# EAGLE design Rotary Encoder (EAGLE 6.2)
SKAARHOJ 2012 Rotary Encoder Breakout Board
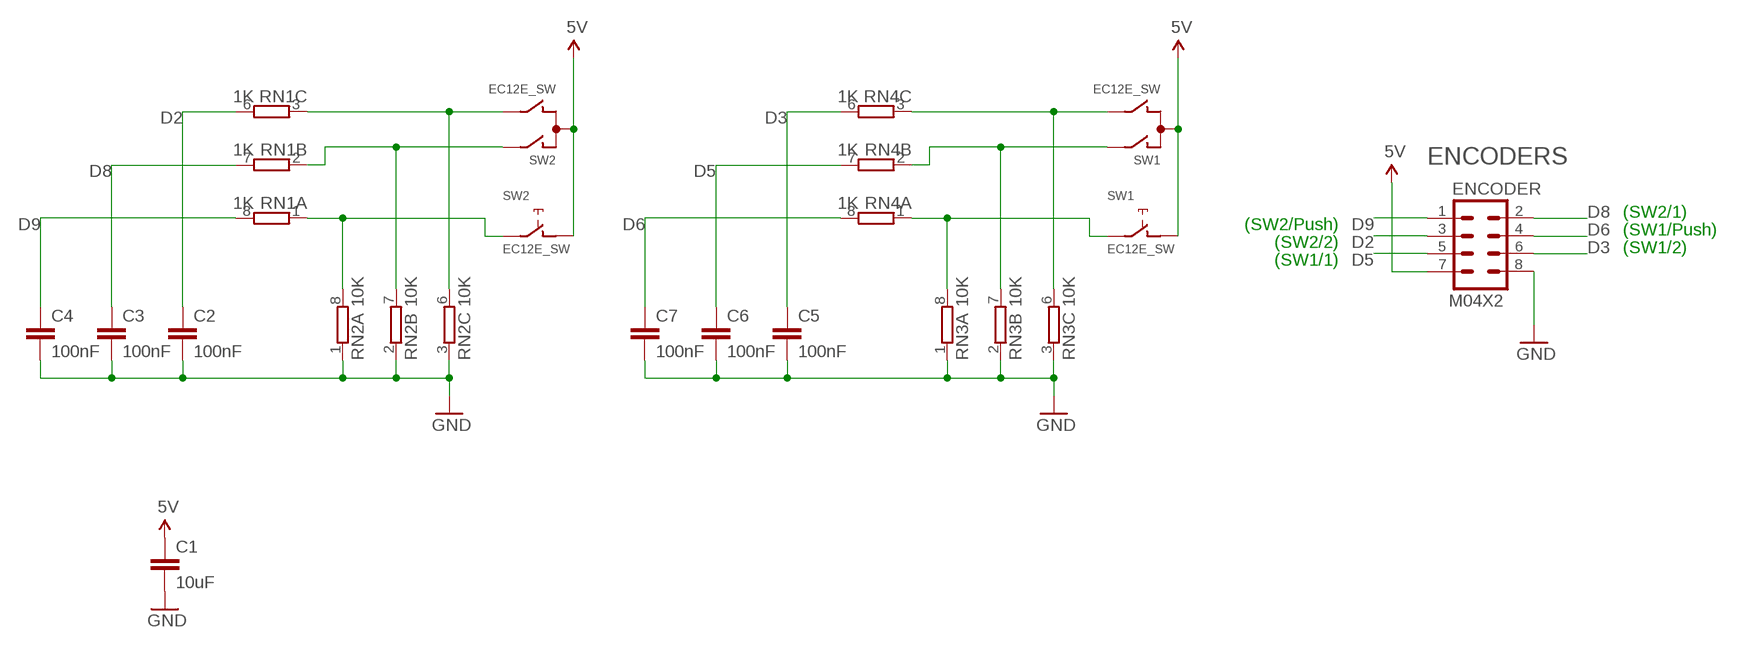
[diagram p0: schematic, sheet 1]

## Parts
C1  10uF  CAP0603-CAP  [0603-CAP]
C2  100nF  CAP0603-CAP  [0603-CAP]
C3  100nF  CAP0603-CAP  [0603-CAP]
C4  100nF  CAP0603-CAP  [0603-CAP]
C5  100nF  CAP0603-CAP  [0603-CAP]
C6  100nF  CAP0603-CAP  [0603-CAP]
C7  100nF  CAP0603-CAP  [0603-CAP]
ENCODER  M04X2  [2X4]
RN1  1K  4R-NCAY16  [CAY16_HAND]
RN2  10K  4R-NCAY16  [CAY16_HAND]
RN3  10K  4R-NCAY16  [CAY16_HAND]
RN4  1K  4R-NCAY16  [CAY16_HAND]
SW1  EC12E_SW  [ALPS_EC12E_SW]
SW2  EC12E_SW  [ALPS_EC12E_SW]

## Nets
5V [Power]: C1.1 ENCODER.7 SW1.C SW1.D SW2.C SW2.D
D2: C2.1 ENCODER.3 RN1.6
D3: C5.1 ENCODER.6 RN4.6
D5: C6.1 ENCODER.5 RN4.7
D6: C7.1 ENCODER.4 RN4.8
D8: C3.1 ENCODER.2 RN1.7
D9: C4.1 ENCODER.1 RN1.8
GND [Power]: C1.2 C2.2 C3.2 C4.2 C5.2 C6.2 C7.2 ENCODER.8 RN2.1 RN2.2 RN2.3 RN3.1 RN3.2 RN3.3
N$1: RN1.3 RN2.6 SW2.B
N$2: RN3.6 RN4.3 SW1.B
N$3: RN3.7 RN4.2 SW1.A
N$4: RN1.2 RN2.7 SW2.A
N$5: RN1.1 RN2.8 SW2.E
N$6: RN3.8 RN4.1 SW1.E
Unconnected: RN1.4 RN1.5 RN2.4 RN2.5 RN3.4 RN3.5 RN4.4 RN4.5 SW1.GND1(G) SW1.GND2(G) SW2.GND1(G) SW2.GND2(G)

## Notes on the sheet
- ENCODERS
- (SW2/Push) | (SW2/1)
- (SW2/2) | (SW1/Push)
- (SW1/1) | (SW1/2)

## Library data of the parts
C1-C7 = SparkFun:CAP: Capacitor Standard 0603 ceramic capacitor, and 0.1" leaded capacitor.
ENCODER = SparkFun:M04X2
RN1-RN4 = SKAARHOJ:4R-N: Array Chip Resistor Source: RS Component / Phycomp; OC_FARNELL: unknown; OC_NEWARK: unknown
SW1 SW2 = switch-alps:EC12E_SW: ALPS rotary Encoder EC12E series with switch; MPN: EC12E2424407; OC_FARNELL: 1520813; OC_NEWARK: 74M1068

## Net classes
0 default: width 0.203 mm, drill 0.406 mm, clearance 0.203 mm
1 Power: width 0.406 mm, drill 0.61 mm, clearance 0.305 mm

## Board
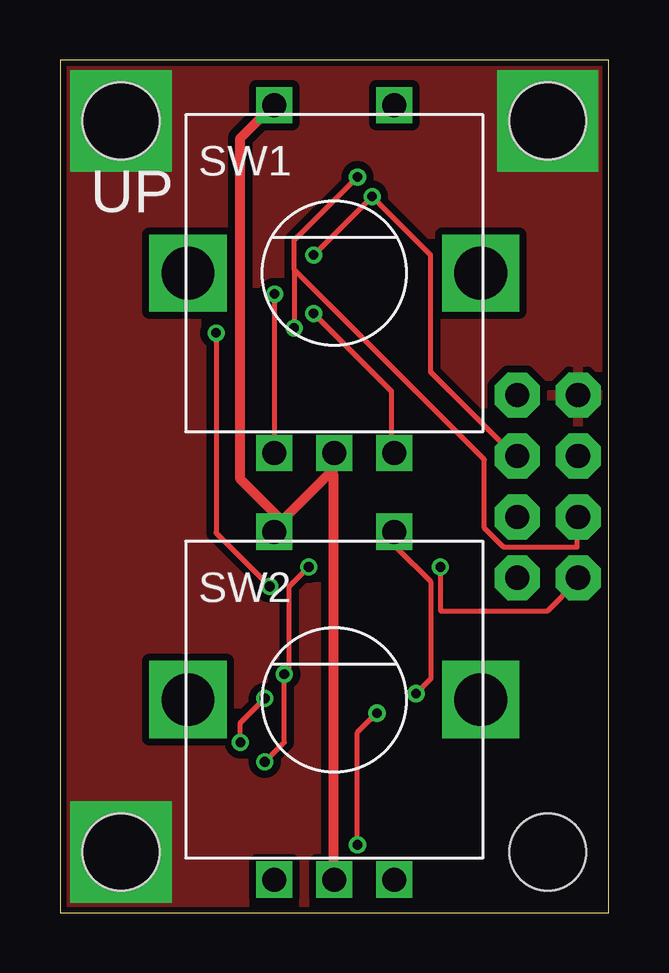
[diagram p1: board, top side]
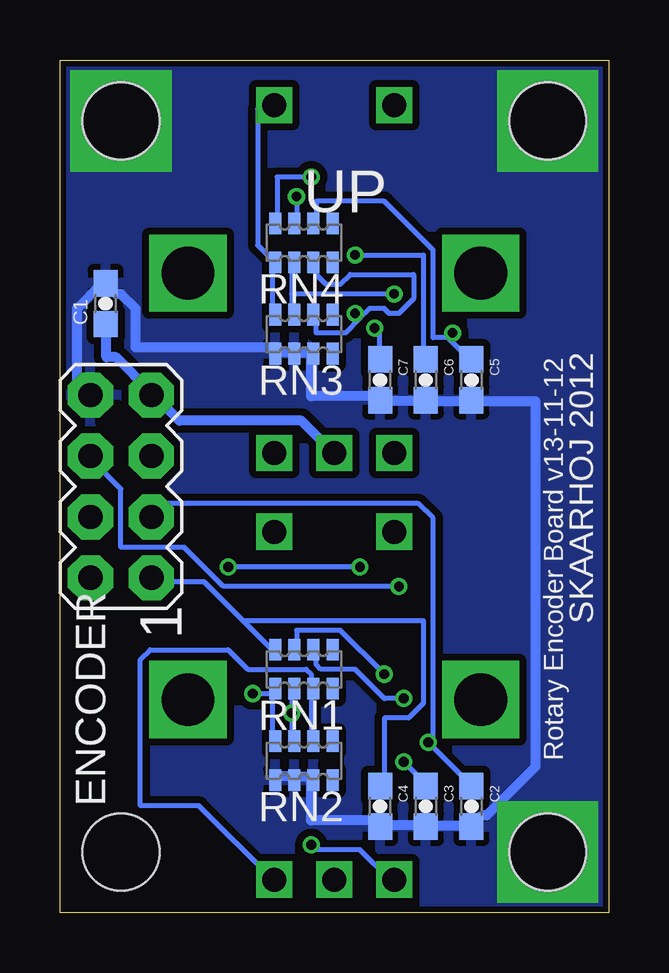
[diagram p2: board, bottom side, seen from below]

Size 22.86 x 35.56 mm. Coordinates in mm from the lower left corner, seen from the top.
Outline: 0,0 22.86,0 22.86,35.56 0,35.56 0,0
Copper layers (1*16): Top 0.035mm / dielectric 1.5mm / Bottom 0.035mm
Design rules: minimum track width 6mil, minimum drill 12mil, track to track 6mil, track to pad 6mil, pad to pad 6mil, via to via 6mil, smd to smd 0mil, copper to edge 10mil, drill to drill 10mil, minimum pad ring 10mil, minimum via ring 6mil, stop-mask expansion 2mil, vias tented up to drill 100mil, thermal gap 10mil
Holes 3.2 mm at 2.54,2.54 2.54,33.02 20.32,33.02 20.32,2.54

### Footprints (pad centres in the part's own frame; a part is rotated, then mirrored left to right if it is on the bottom)
0603-CAP = smd 1.1 x 1: 1 -0.85,0; 2 0.85,0
2X4 = drill 1.016 pad 1.88 octagon: 1 -3.81,-1.27; 2 -3.81,1.27; 3 -1.27,-1.27; 4 -1.27,1.27; 5 1.27,-1.27; 6 1.27,1.27; 7 3.81,-1.27; 8 3.81,1.27
CAY16_HAND = smd 0.5 x 0.904: 1 -1.2,-0.813; 2 -0.4,-0.813; 3 0.4,-0.813; 4 1.2,-0.813; 5 1.2,0.813; 6 0.4,0.813; 7 -0.4,0.813; 8 -1.2,0.813
ALPS_EC12E_SW = drill 1 square: A -2.5,-7.5; B 2.5,-7.5; C 0,-7.5; D -2.5,7; E 2.5,7 | drill 2.2 square: GND1 -6.1,0; GND2 6.1,0

### Placement (x,y rotation side)
C1  20.95,25.4 90 bottom
C2  5.71,4.45 270 bottom
C3  7.62,4.45 270 bottom
C4  9.53,4.45 270 bottom
C5  5.71,22.23 270 bottom
C6  7.62,22.23 270 bottom
C7  9.53,22.23 270 bottom
ENCODER  20.32,17.78 90 bottom
RN1  12.7,10.16 0 bottom
RN2  12.7,6.35 0 bottom
RN3  12.7,24.13 0 bottom
RN4  12.7,27.94 0 bottom
SW1  11.43,26.67 0 top
SW2  11.43,8.89 0 top

### Tracks (layer width: path | path; a pad name or v marks a point on that pad's centre or on a via)
5V
  Top 0.406: 11.28,18.39 11.38,18.49 11.38,19.1 SW1.C | 11.28,18.39 8.94,16.05 SW2.D 9.14,16.46 7.52,18.09 7.52,32.31 8.74,33.53 SW1.D | SW2.C 11.38,1.42 11.38,18.29 11.28,18.39
  Bottom 0.406: C1.1 20.93,24.38 20.93,23.16 20.52,23.16 19.1,21.74 ENCODER.7 18.9,21.54 17.88,20.52 12.8,20.52 11.58,19.3 SW1.C
D2  (via drill 0.41)
  Top 0.203: v8.53,8.94 7.52,7.92 v7.52,7.11
  Bottom 0.203: v8.53,8.94 9.35,8.94 10.57,10.16 11.99,10.16 12.19,10.36 12.19,10.97 RN1.6 | C2.1 5.89,5.49 v7.52,7.11 7.32,7.11 7.32,16.46 7.92,17.07 18.49,17.07 ENCODER.3
D3  (via drill 0.41)
  Top 0.203: v8.74,13.61 6.5,15.85 v6.5,24.18
  Bottom 0.203: 6.71,23.98 7.32,23.98 7.32,27.64 9.35,29.67 12.19,29.67 12.19,28.85 RN4.6 | 6.71,23.98 5.89,23.16 C5.1 | v8.74,13.61 16.05,13.61 17.68,15.24 20.32,15.24 20.32,17.68 21.54,18.9 ENCODER.6 | 6.71,23.98 v6.5,24.18
D5  (via drill 0.41)
  Top 0.203: ENCODER.5 18.9,19.1 15.44,22.55 15.44,27.43 v13.01,29.87 v10.57,27.43
  Bottom 0.203: v13.01,29.87 13.01,28.85 RN4.7 | v10.57,27.43 7.72,27.43 7.72,23.16 C6.1
D6  (via drill 0.41)
  Top 0.203: v12.39,30.68 9.75,28.04 9.75,26.82 | 9.75,26.82 17.68,18.9 17.68,16.05 18.49,15.24 21.54,15.24 21.54,16.46 ENCODER.4 | 9.75,26.82 v9.75,24.38
  Bottom 0.203: v12.39,30.68 13.82,30.68 13.82,28.85 RN4.8 | v9.75,24.38 9.55,24.38 9.55,23.16 C7.1
D8  (via drill 0.41)
  Top 0.203: v8.53,6.3 9.35,7.11 v9.35,9.96 9.55,10.16 9.55,13.61 v10.36,14.43 | v15.85,14.43 15.85,12.6 20.32,12.6 21.54,13.82 ENCODER.2
  Bottom 0.203: v9.35,9.96 11.18,11.79 13.01,11.79 13.01,10.97 RN1.7 | v8.53,6.3 7.72,5.49 C3.1 | v10.36,14.43 v15.85,14.43
D9
  Bottom 0.203: 15.24,12.19 16.87,13.82 18.9,13.82 ENCODER.1 | 15.24,12.19 14.02,10.97 RN1.8 | 15.24,12.19 7.72,12.19 7.72,8.74 8.33,8.13 9.35,8.13 9.35,5.49 C4.1
GND  (via drill 3.2)
  Bottom 0.406: ENCODER.8 21.74,21.74 22.15,21.74 22.15,25.2 21.13,26.21 C1.2 20.93,26.21 20.52,25.81 20.32,25.81 19.71,25.2 19.71,23.57 13.82,23.57 RN3.1 13.82,23.37 13.21,23.37 RN3.2 13.01,23.37 12.39,23.37 RN3.3 12.39,23.16 12.39,21.54 9.55,21.54 C7.2 9.35,21.34 7.72,21.34 C6.2 7.52,21.34 5.89,21.34 C5.2 5.69,21.34 3.05,21.34 3.05,6.1 5.08,4.06 5.28,4.06 5.69,3.66 C2.2 5.89,3.66 7.52,3.66 C3.2 7.72,3.66 9.35,3.66 C4.2 9.35,3.86 12.39,3.86 12.39,5.49 RN2.3 12.39,5.69 13.01,5.69 RN2.2 13.21,5.69 13.82,5.69 RN2.1
  other vias: 2.54,2.54 2.54,33.02 20.32,33.02
  pour Bottom: 0,35.56 22.86,35.56 22.86,0 0,0
  pour Top: 0,35.56 22.86,35.56 22.86,0 0,0
N$1
  Bottom 0.203: 12.39,9.35 12.39,7.32 RN2.6 | 12.39,9.35 12.39,9.96 12.6,10.16 15.04,10.16 15.85,10.97 19.1,10.97 19.51,10.57 19.51,4.47 17.07,4.47 14.02,1.42 SW2.B | 12.39,9.35 RN1.3
N$2  (via drill 0.41)
  Top 0.203: v10.57,24.99 13.82,21.74 13.82,19.3 SW1.B
  Bottom 0.203: 10.36,24.79 9.96,25.2 9.35,25.2 9.14,24.99 8.74,24.99 8.13,25.6 8.13,26.62 10.77,26.62 11.18,26.21 11.79,26.21 12.19,26.62 12.19,27.03 RN4.3 | 10.36,24.79 10.97,24.18 12.19,24.18 12.19,24.79 RN3.6 | v10.57,24.99 10.36,24.79
N$3  (via drill 0.41)
  Top 0.203: v8.94,25.81 8.94,19.3 SW1.A
  Bottom 0.203: 13.21,25.81 13.21,27.03 RN4.2 | 13.21,25.81 13.21,24.99 RN3.7 | v8.94,25.81 13.21,25.81
N$4  (via drill 0.41)
  Top 0.203: v13.21,8.33 12.39,7.52 v12.39,2.85
  Bottom 0.203: RN2.7 13.21,7.32 v13.21,8.33 13.21,9.35 RN1.2 | v12.39,2.85 12.19,2.64 10.36,2.64 9.14,1.42 8.94,1.42 SW2.A
N$5  (via drill 0.41)
  Top 0.203: v14.83,9.14 15.44,9.75 15.44,13.82 14.02,15.24 14.02,15.85 SW2.E
  Bottom 0.203: 14.02,9.14 14.02,9.35 RN1.1 14.02,9.14 | 14.02,9.14 14.02,7.32 RN2.8 | v14.83,9.14 14.02,9.14
N$6
  Bottom 0.203: RN3.8 14.02,24.99 14.02,27.03 RN4.1 14.02,27.23 14.63,27.84 14.63,33.53 14.02,33.53 SW1.E

### Text on the board
_tsilk: UP
_bsilk: UP | SKAARHOJ 2012 | 1 | Rotary Encoder Board v13-11-12